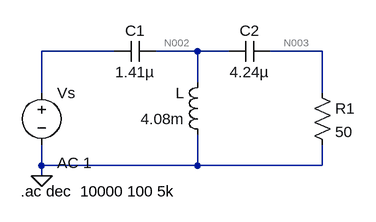
[diagram p0: schematic (2)ButHPF.asc]
(2)ButHPF.asc, the LTspice schematic file:
Version 4
SHEET 1 880 680
WIRE 112 48 0 48
WIRE 240 48 176 48
WIRE 288 48 240 48
WIRE 432 48 352 48
WIRE 240 96 240 48
WIRE 0 112 0 48
WIRE 432 112 432 48
WIRE 0 224 0 192
WIRE 240 224 240 176
WIRE 240 224 0 224
WIRE 432 224 432 192
WIRE 432 224 240 224
WIRE 0 240 0 224
FLAG 0 240 0
SYMBOL voltage 0 96 R0
WINDOW 123 24 124 Left 2
WINDOW 39 0 0 Left 2
SYMATTR Value2 AC 1
SYMATTR InstName Vs
SYMATTR Value ""
SYMBOL ind 256 192 R180
WINDOW 0 36 80 Left 2
WINDOW 3 36 40 Left 2
SYMATTR InstName L
SYMATTR Value 4.08m
SYMBOL res 416 96 R0
SYMATTR InstName R1
SYMATTR Value 50
SYMBOL cap 352 32 R90
WINDOW 0 0 32 VBottom 2
WINDOW 3 32 32 VTop 2
SYMATTR InstName C2
SYMATTR Value 4.24µ
SYMBOL cap 176 32 R90
WINDOW 0 0 32 VBottom 2
WINDOW 3 32 32 VTop 2
SYMATTR InstName C1
SYMATTR Value 1.41µ
TEXT -32 264 Left 2 !.ac dec  10000 100 5k

The netlist it stands for:
* (2)ButHPF.asc
Vs N001 0 AC 1
L 0 N002 4.08m
R1 N003 0 50
C2 N003 N002 4.24µ
C1 N002 N001 1.41µ
.ac dec  10000 100 5k
.backanno
.end

* Results of the author's LTspice run, read from the files saved beside the schematic
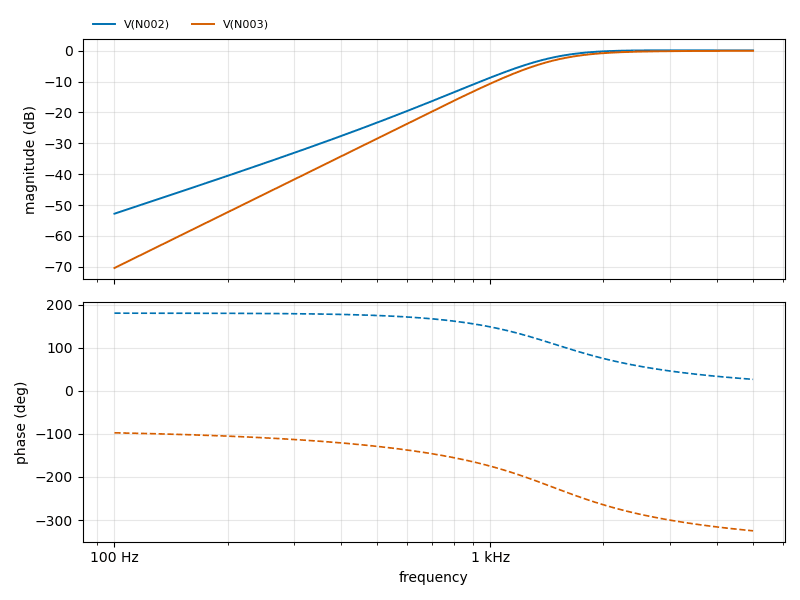
[diagram p1: AC Analysis of (2)ButHPF.asc, plotted from the saved traces]
* AC Analysis, 1 run:
*   V(N002): -52.80 dB at 100 Hz, 0.06 dB at 5 kHz, peak 0.11 dB at 2.974 kHz, 3 dB below the peak at 1.388 kHz
*   V(N003): -70.38 dB at 100 Hz, -0.04 dB at 5 kHz, peak -0.04 dB at 5 kHz, 3 dB below the peak at 1.487 kHz